# Altium schematic sheet Scheme.SchDoc
size A2; SheetNumber: 1; SheetTotal: 2
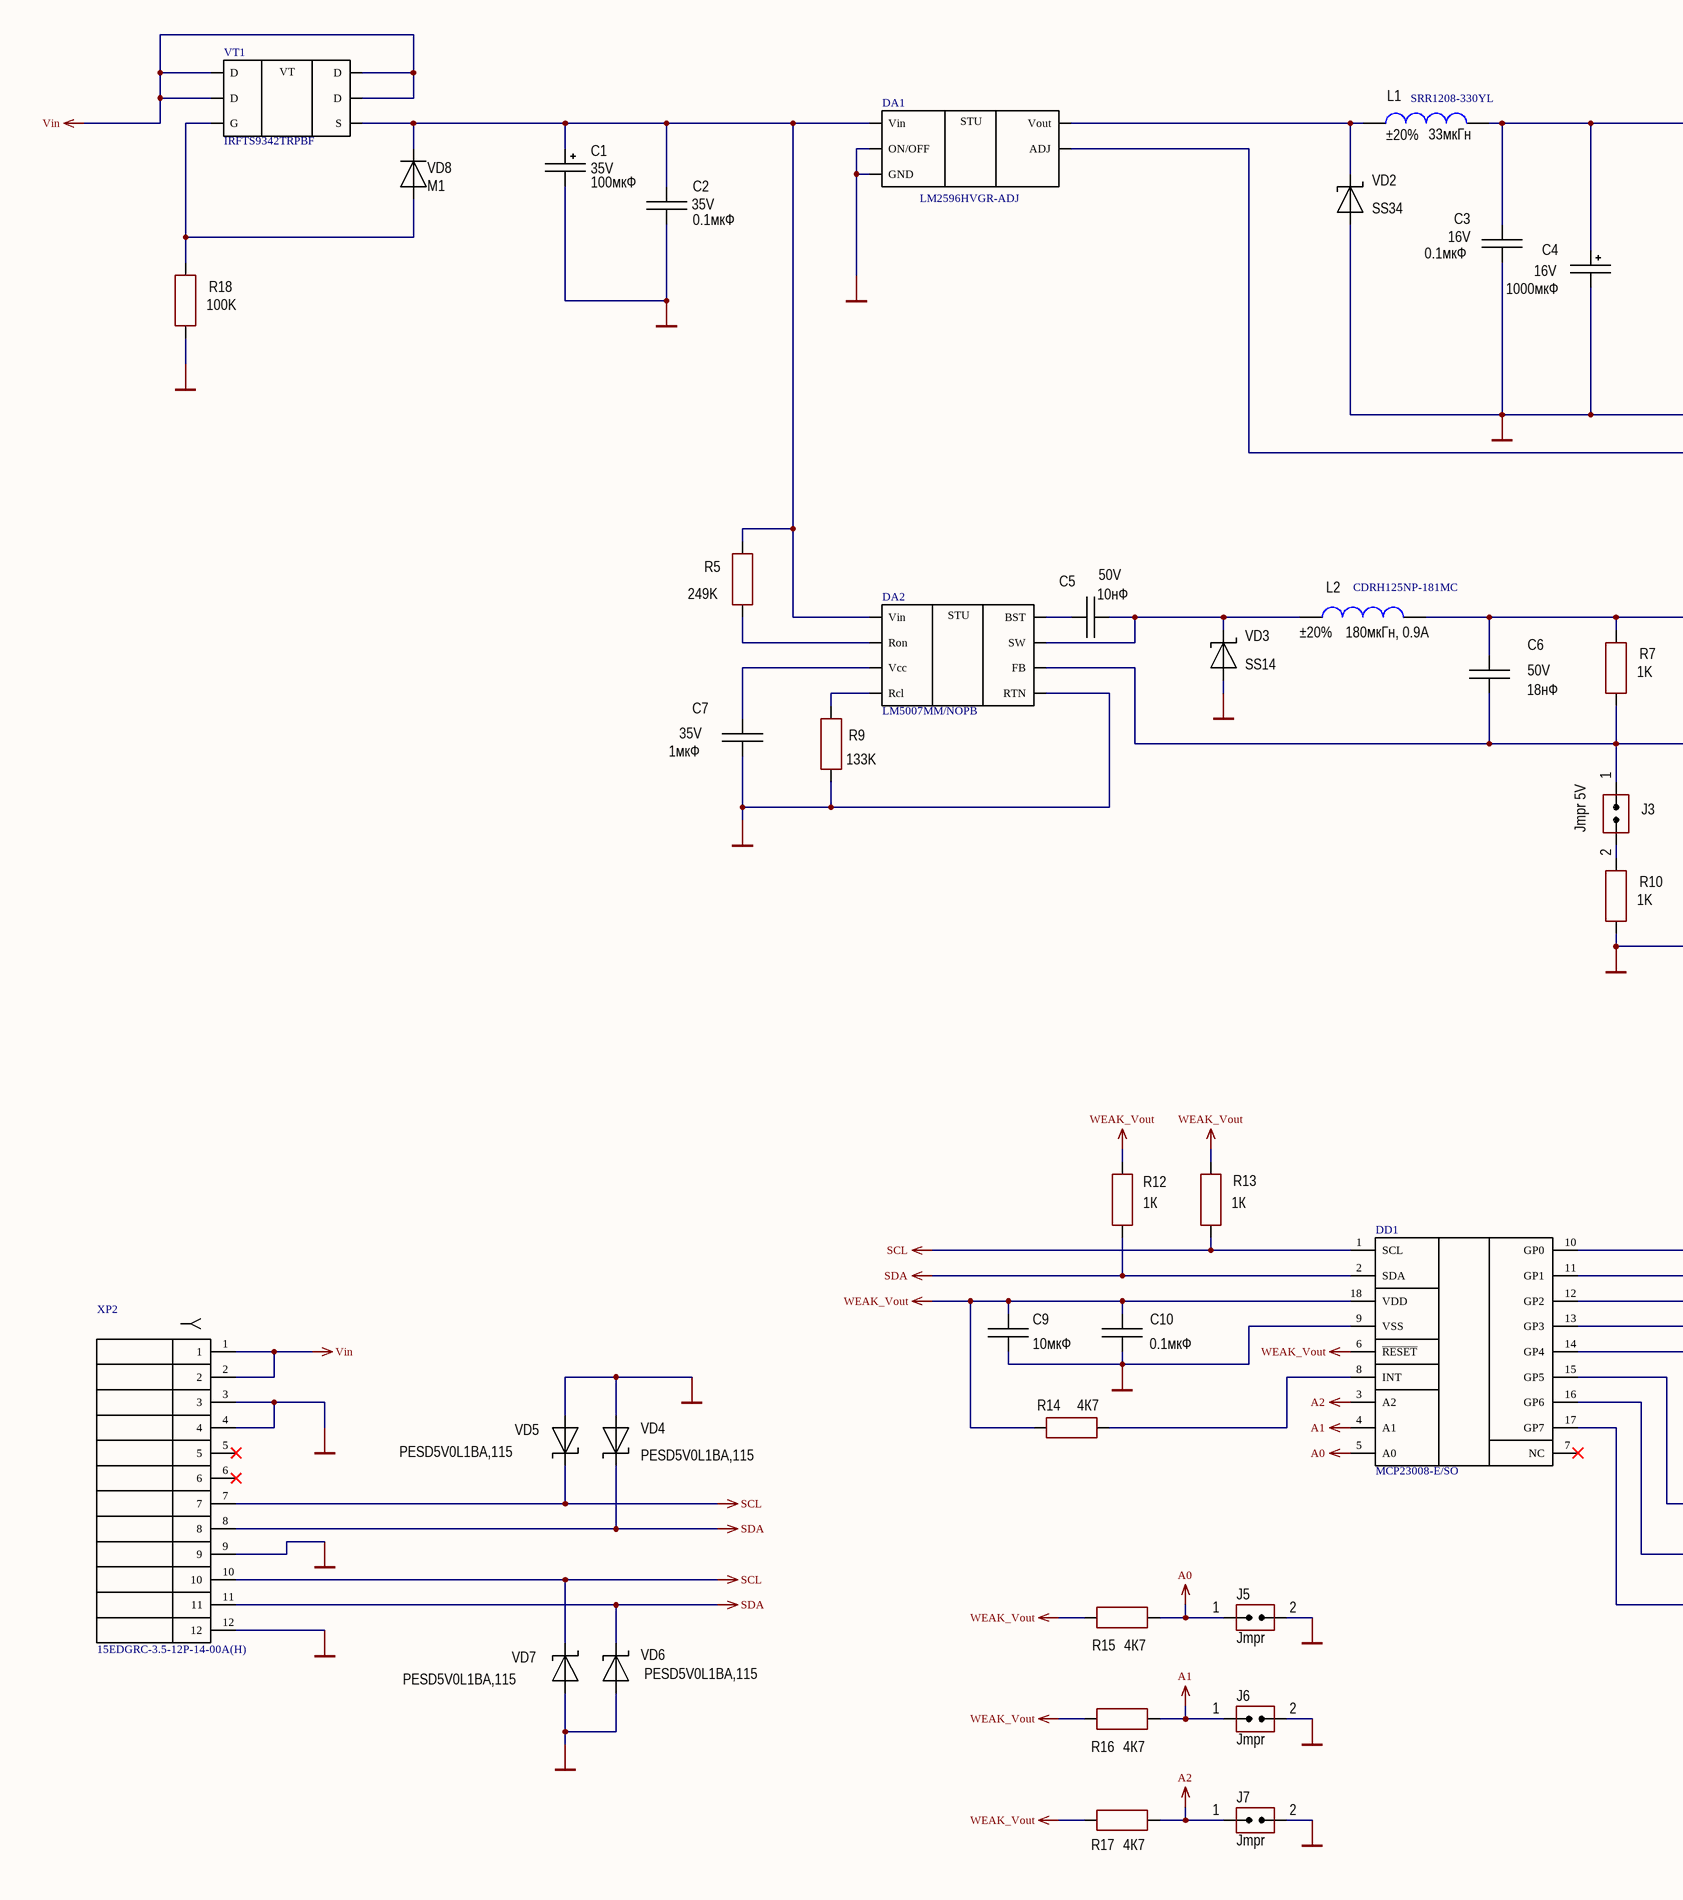
[diagram p0: Scheme.SchDoc, left]
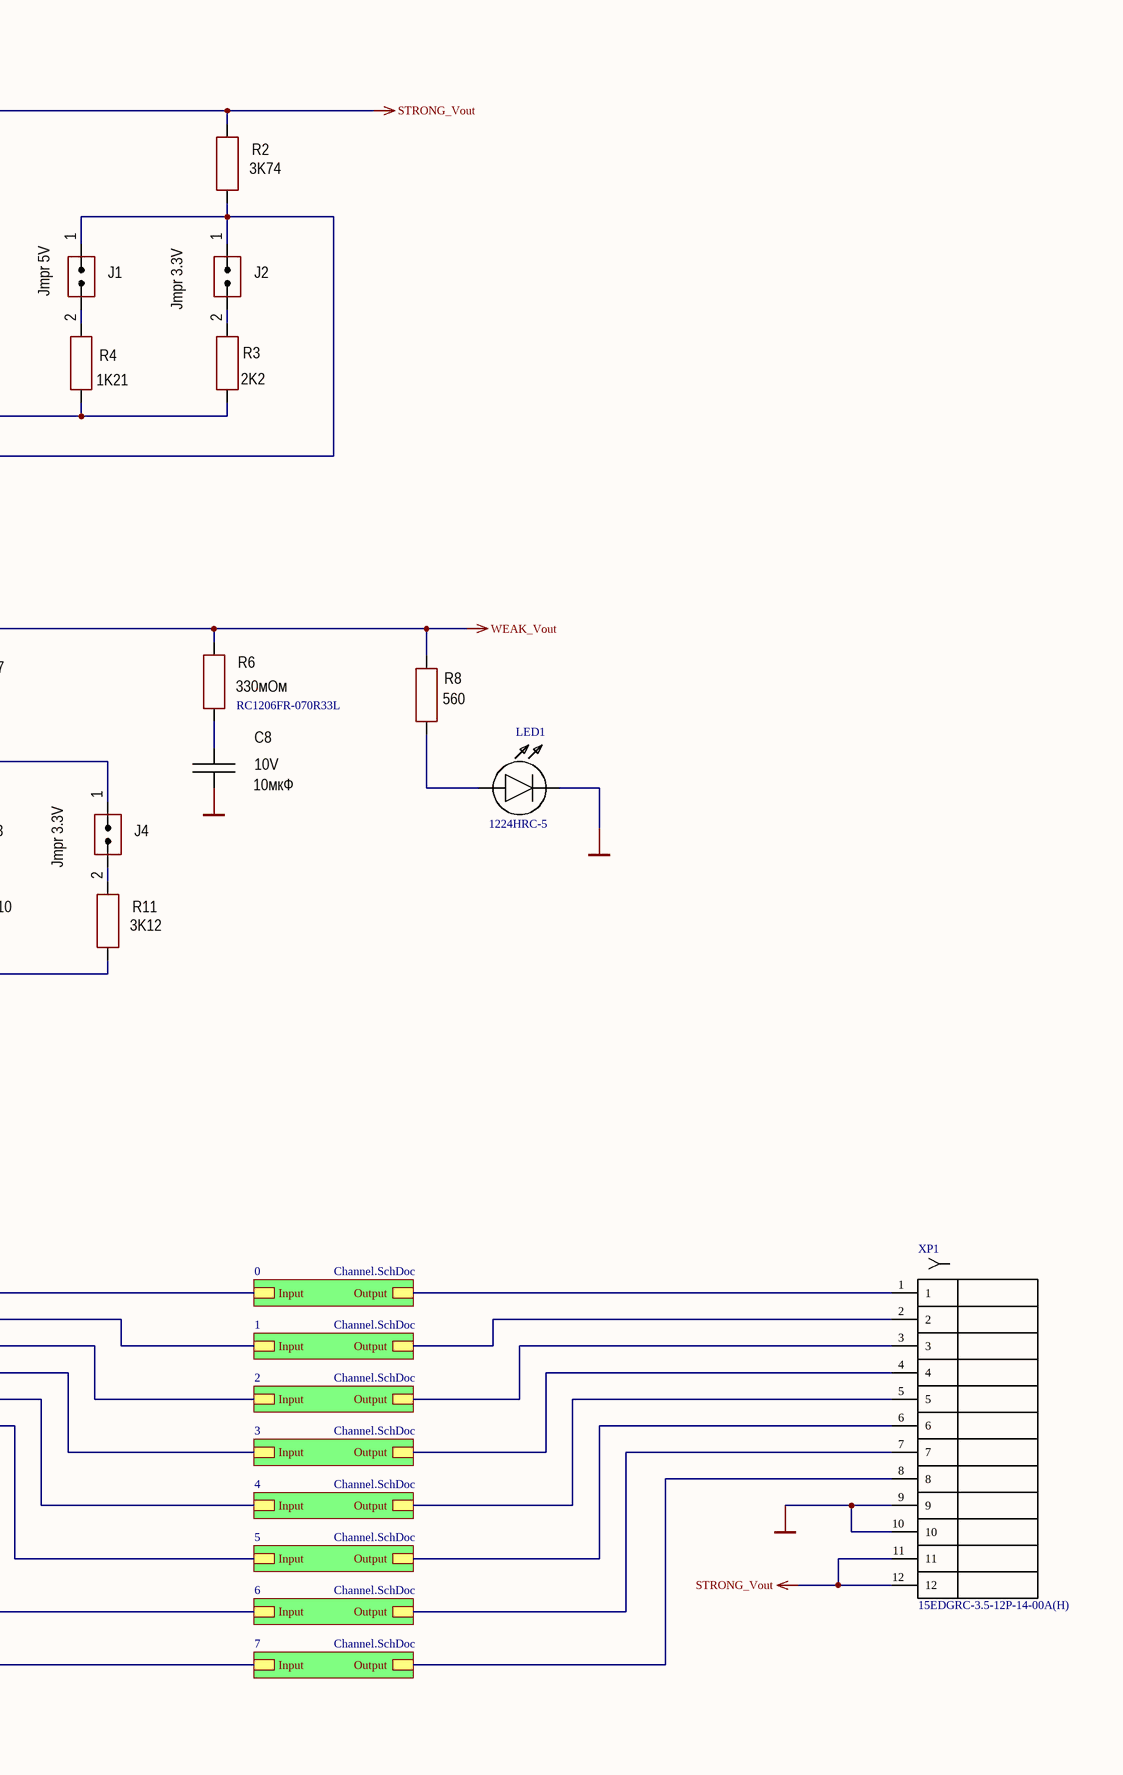
[diagram p1: Scheme.SchDoc, right]

## Parts
C1  value 100мкФ  Voltage: 35V  [CAP: D6.3C2.5H11]
C2  value 0.1мкФ  Voltage: 35V  [CAP: 0805]
C3  value 0.1мкФ  Voltage: 16V  [CAP: 0805]
C4  value 1000мкФ  Voltage: 16V  [CAP: D10C5H16]
C5  value 10нФ  Voltage: 50V  [CAP: 0805]
C6  value 18нФ  Voltage: 50V  [CAP: 0805]
C7  value 1мкФ  Voltage: 35V  [CAP: 0805]
C8  value 10мкФ  Voltage: 10V  [CAP: 0805]
C9  value 10мкФ  [CAP: 0805]
C10  value 0.1мкФ  [CAP: 0805]
DA1  LM2596HVGR-ADJ  [to-263-5l]
DA2  LM5007MM/NOPB  [8-VSSOP_EDIT]
DD1  MCP23008-E/SO  [18-SOIC]
J1  CommentText: Jmpr 5V  [CON: JUMPER x1]
J2  CommentText: Jmpr 3.3V  [CON: JUMPER x1]
J3  CommentText: Jmpr 5V  [CON: JUMPER x1]
J4  CommentText: Jmpr 3.3V  [CON: JUMPER x1]
J5  CommentText: Jmpr  [CON: JUMPER x1]
J6  CommentText: Jmpr  [CON: JUMPER x1]
J7  CommentText: Jmpr  [CON: JUMPER x1]
L1  value 33мкГн  Tolerance: ±20%  [SRR1208-330YL]
L2  value 180мкГн, 0.9A  Tolerance: ±20%  [CDRH125NP-181MC]
LED1  1224HRC-5  [1224HRC5]
R2  value 3K74  [RES: 0805]
R3  value 2K2  [RES: 0805]
R4  value 1K21  [RES: 0805]
R5  value 249K  [RES: 0805]
R6  RC1206FR-070R33L  value 330мОм  [RES: 1206]
R7  value 1K  [RES: 0805]
R8  value 560  [RES: 0805]
R9  value 133K  [RES: 0805]
R10  value 1K  [RES: 0805]
R11  value 3K12  [RES: 0805]
R12  value 1К  [RES: 0805]
R13  value 1К  [RES: 0805]
R14  value 4К7  [RES: 0805]
R15  value 4К7  [RES: 0805]
R16  value 4К7  [RES: 0805]
R17  value 4К7  [RES: 0805]
R18  value 100K  [RES: 0805]
VD2  PartNumber: SS34  [DIODE: SMC]
VD3  PartNumber: SS14  [DIODE: SMA]
VD4  PartNumber: PESD5V0L1BA,115  [DIODE: SOD323]
VD5  PartNumber: PESD5V0L1BA,115  [DIODE: SOD323]
VD6  PartNumber: PESD5V0L1BA,115  [DIODE: SOD323]
VD7  PartNumber: PESD5V0L1BA,115  [DIODE: SOD323]
VD8  PartNumber: M1  [DIODE: SMA]
VT1  IRFTS9342TRPBF  [6-TSOP]
XP1  15EDGRC-3.5-12P-14-00A(H)  [15EDGRC-3.5-12P-14-00A(H)]
XP2  15EDGRC-3.5-12P-14-00A(H)  [15EDGRC-3.5-12P-14-00A(H)]

## Sub-sheets
0 = Channel.SchDoc: Input, Output
1 = Channel.SchDoc: Input, Output
2 = Channel.SchDoc: Input, Output
3 = Channel.SchDoc: Input, Output
4 = Channel.SchDoc: Input, Output
5 = Channel.SchDoc: Input, Output
6 = Channel.SchDoc: Input, Output
7 = Channel.SchDoc: Input, Output

## Nets
A0: DD1.5(A0) J5.1(IN) R15.2
A1: DD1.4(A1) J6.1(IN) R16.2
A2: DD1.3(A2) J7.1(IN) R17.2
GND: C1.2 C2.1 C3.1 C4.2 C7.1 C8.2 C9.1 C10.1 DA1.3(GND) DA1.5(ON/OFF) DA2.4(RTN) DD1.9(VSS) J5.2(IN) J6.2(IN) J7.2(IN) LED1.1(K) R3.2 R4.1 R9.2 R10.1 R11.1 R18.1 VD2.1 VD3.1 VD4.1 VD5.1 VD6.1 VD7.1 XP1.9 XP1.10 XP2.3 XP2.4 XP2.9 XP2.12
SCL: DD1.1(SCL) R13.1 VD5.2 VD7.2 XP2.7 XP2.10
SDA: DD1.2(SDA) R12.1 VD4.2 VD6.2 XP2.8 XP2.11
STRONG_Vout: C3.2 C4.1 L1.1 R2.2 XP1.11 XP1.12
Vin: VT1.1(D) VT1.2(D) VT1.5(D) VT1.6(D) XP2.1 XP2.2
WEAK_Vout: C6.1 C9.2 C10.2 DD1.6(~{RESET}) DD1.18(VDD) L2.1 R6.2 R7.2 R8.1 R12.2 R13.2 R14.1 R15.1 R16.1 R17.1
NetC1_1: C1.1 C2.2 DA1.1(Vin) DA2.8(Vin) R5.2 VD8.2 VT1.4(S)
NetC5_1: C5.1 DA2.1(SW) L2.2 VD3.2
NetC5_2: C5.2 DA2.2(BST)
NetC6_2: C6.2 DA2.5(FB) J3.1(IN) J4.1(IN) R7.1
NetC7_2: C7.2 DA2.7(Vcc)
NetC8_1: C8.1 R6.1
NetDA1_2: DA1.2(Vout) L1.2 VD2.2
NetDA1_4: DA1.4(ADJ) J1.1(IN) J2.1(IN) R2.1
NetDA2_3: DA2.3(Rcl) R9.1
NetDA2_6: DA2.6(Ron) R5.1
NetDD1_8: DD1.8(INT) R14.2
NetDD1_10: DD1.10(GP0) ; sheet 0/Input
NetDD1_11: DD1.11(GP1) ; sheet 1/Input
NetDD1_12: DD1.12(GP2) ; sheet 2/Input
NetDD1_13: DD1.13(GP3) ; sheet 3/Input
NetDD1_14: DD1.14(GP4) ; sheet 4/Input
NetDD1_15: DD1.15(GP5) ; sheet 5/Input
NetDD1_16: DD1.16(GP6) ; sheet 6/Input
NetDD1_17: DD1.17(GP7) ; sheet 7/Input
NetJ1_2: J1.2(IN) R4.2
NetJ2_2: J2.2(IN) R3.1
NetJ3_2: J3.2(IN) R10.2
NetJ4_2: J4.2(IN) R11.2
NetLED1_2: LED1.2(A) R8.2
NetR18_2: R18.2 VD8.1 VT1.3(G)
NetXP1_1: XP1.1 ; sheet 0/Output
NetXP1_2: XP1.2 ; sheet 1/Output
NetXP1_3: XP1.3 ; sheet 2/Output
NetXP1_4: XP1.4 ; sheet 3/Output
NetXP1_5: XP1.5 ; sheet 4/Output
NetXP1_6: XP1.6 ; sheet 5/Output
NetXP1_7: XP1.7 ; sheet 6/Output
NetXP1_8: XP1.8 ; sheet 7/Output

Not connected (* = marked no-connect by the designer): DD1 7(NC)*; XP2 5* 6*

## Notes on the sheet
- (near L1) SRR1208-330YL
- (near L2) CDRH125NP-181MC
- (in symbol IRFTS9342TRPBF) VT
- (in symbol LM2596HVGR-ADJ) STU
- (in symbol LM5007MM/NOPB) STU

## Library data of the parts
C1 = Aluminium: Manufacturer: Wurth; PartNumber: 860080475013; ValueManufacturerPartNumber: Aluminium capacitor, 100мкФ, 35V, ±20%, 54mOhm, 14x10x5 mm, -55...+105°C; TypeCapacitor: Aluminium capacitor; Tolerance: ±20%; Impedance: 54mOhm; Package: 14x10x5 mm; HelpURL: https://www.digikey.com/product-detail/en/wurth-electronics-inc/860080475013/732-9029-1-ND/5728972; Temperature: -55...+105°C
C2 = Ceramic_0805: Manufacturer: Yageo; PartNumber: CC0805KRX7R7BB104; ValueManufacturerPartNumber: Ceramic capacitor, 0.1мкФ, X7R, ±10%, 35V, 0805, -55...+125°C; TypeCapacitor: Ceramic capacitor; Tolerance: ±10%; TypeDielectric: X7R; Package: 0805; HelpURL: https://www.digikey.com/product-detail/en/yageo/CC0805KRX7R7BB104/311-1142-1-ND/303052; Temperature: -55...+125°C
C3 = Ceramic_0805: Manufacturer: Yageo; PartNumber: CC0805KRX7R7BB104; ValueManufacturerPartNumber: Ceramic capacitor, 0.1мкФ, X7R, ±10%, 16V, 0805, -55...+125°C; TypeCapacitor: Ceramic capacitor; Tolerance: ±10%; TypeDielectric: X7R; Package: 0805; HelpURL: https://www.digikey.com/product-detail/en/yageo/CC0805KRX7R7BB104/311-1142-1-ND/303052; Temperature: -55...+125°C
C4 = Aluminium: Manufacturer: Wurth; PartNumber: 860080475013; ValueManufacturerPartNumber: Aluminium capacitor, 1000мкФ, 16V, ±20%, 54mOhm, 14x10x5 mm, -55...+105°C; TypeCapacitor: Aluminium capacitor; Tolerance: ±20%; Impedance: 54mOhm; Package: 14x10x5 mm; HelpURL: https://www.digikey.com/product-detail/en/wurth-electronics-inc/860080475013/732-9029-1-ND/5728972; Temperature: -55...+105°C
C5 = Ceramic_0805: Manufacturer: Yageo; PartNumber: CC0805KRX7R7BB104; ValueManufacturerPartNumber: Ceramic capacitor, 10нФ, X7R, ±10%, 50V, 0805, -55...+125°C; TypeCapacitor: Ceramic capacitor; Tolerance: ±10%; TypeDielectric: X7R; Package: 0805; HelpURL: https://www.digikey.com/product-detail/en/yageo/CC0805KRX7R7BB104/311-1142-1-ND/303052; Temperature: -55...+125°C
C6 = Ceramic_0805: Manufacturer: Yageo; PartNumber: CC0805KRX7R7BB104; ValueManufacturerPartNumber: Ceramic capacitor, 18нФ, X7R, ±10%, 50V, 0805, -55...+125°C; TypeCapacitor: Ceramic capacitor; Tolerance: ±10%; TypeDielectric: X7R; Package: 0805; HelpURL: https://www.digikey.com/product-detail/en/yageo/CC0805KRX7R7BB104/311-1142-1-ND/303052; Temperature: -55...+125°C
C7 = Ceramic_0805: Manufacturer: Yageo; PartNumber: CC0805KRX7R7BB104; ValueManufacturerPartNumber: Ceramic capacitor, 1мкФ, X7R, ±10%, 35V, 0805, -55...+125°C; TypeCapacitor: Ceramic capacitor; Tolerance: ±10%; TypeDielectric: X7R; Package: 0805; HelpURL: https://www.digikey.com/product-detail/en/yageo/CC0805KRX7R7BB104/311-1142-1-ND/303052; Temperature: -55...+125°C
C8 = Ceramic_0805: Manufacturer: Yageo; PartNumber: CC0805KRX7R7BB104; ValueManufacturerPartNumber: Ceramic capacitor, 10мкФ, X7R, ±10%, 10V, 0805, -55...+125°C; TypeCapacitor: Ceramic capacitor; Tolerance: ±10%; TypeDielectric: X7R; Package: 0805; HelpURL: https://www.digikey.com/product-detail/en/yageo/CC0805KRX7R7BB104/311-1142-1-ND/303052; Temperature: -55...+125°C
C9 = Ceramic_0805: Manufacturer: Yageo; PartNumber: CC0805KRX7R7BB104; ValueManufacturerPartNumber: Ceramic capacitor, 10мкФ, X7R, ±10%, 16V, 0805, -55...+125°C; TypeCapacitor: Ceramic capacitor; Tolerance: ±10%; TypeDielectric: X7R; Voltage: 16V; Package: 0805; HelpURL: https://www.digikey.com/product-detail/en/yageo/CC0805KRX7R7BB104/311-1142-1-ND/303052; Temperature: -55...+125°C
C10 = Ceramic_0805: Manufacturer: Yageo; PartNumber: CC0805KRX7R7BB104; ValueManufacturerPartNumber: Ceramic capacitor, 0.1мкФ, X7R, ±10%, 16V, 0805, -55...+125°C; TypeCapacitor: Ceramic capacitor; Tolerance: ±10%; TypeDielectric: X7R; Voltage: 16V; Package: 0805; HelpURL: https://www.digikey.com/product-detail/en/yageo/CC0805KRX7R7BB104/311-1142-1-ND/303052; Temperature: -55...+125°C
DA1 = LM2596HVGR-ADJ: Step-down DC-DC, 3A
DA2 = LM5007MM/NOPB: Step-down DC-DC, 0.5A
DD1 = MCP23008-E/SO: Integrated Circuit
J1-J7 = Jumper_single
L1 = Inductor_0805: https://www.chipdip.ru/product/srr1208-330yl; Manufacturer: Murata Electronics; PartNumber: LQM21FN100M70L; ValueManufacturerPartNumber: Fixed inductor, 33мкГн, ±20%, 0805, 100mA, -55...+125°C; TypeInductor: Fixed inductor; MaxCurrent: 100mA; Package: 0805; HelpURL: https://www.digikey.com/product-detail/en/murata-electronics-north-america/LQM21FN100M70L/490-4029-1-ND/1016289; Temperature: -55...+125°C
L2 = Inductor_0805: https://www.chipdip.ru/product/srr1208-330yl; Manufacturer: Murata Electronics; PartNumber: LQM21FN100M70L; ValueManufacturerPartNumber: Fixed inductor, 180мкГн, 0.9A, ±20%, 0805, 100mA, -55...+125°C; TypeInductor: Fixed inductor; MaxCurrent: 100mA; Package: 0805; HelpURL: https://www.digikey.com/product-detail/en/murata-electronics-north-america/LQM21FN100M70L/490-4029-1-ND/1016289; Temperature: -55...+125°C
LED1 = 1224HRC-5: LED; Manufacturer_Name: Everlight; Datasheet Link: https://www.digchip.com/datasheets/parts/datasheet/158/1224HRC-5-pdf.php; Height: 5.5mm; Manufacturer_Part_Number: 1224HRC-5
R2 = Resistor_0805: Manufacturer: Yageo; PartNumber: RC0805JR-07100RL; ValueManufacturerPartNumber: Resistor film, 3K74, ±5%, 0805, 0.125W, -55...+125°C; TypeResistor: Resistor film; Power: 0.125W; Tolerance: ±5%; Package: 0805; HelpURL: https://www.digikey.com/product-detail/en/yageo/RC0805JR-07100RL/311-100ARCT-ND/731185; Temperature: -55...+125°C
R3 = Resistor_0805: Manufacturer: Yageo; PartNumber: RC0805JR-07100RL; ValueManufacturerPartNumber: Resistor film, 2K2, ±5%, 0805, 0.125W, -55...+125°C; TypeResistor: Resistor film; Power: 0.125W; Tolerance: ±5%; Package: 0805; HelpURL: https://www.digikey.com/product-detail/en/yageo/RC0805JR-07100RL/311-100ARCT-ND/731185; Temperature: -55...+125°C
R4 = Resistor_0805: Manufacturer: Yageo; PartNumber: RC0805JR-07100RL; ValueManufacturerPartNumber: Resistor film, 1K21, ±5%, 0805, 0.125W, -55...+125°C; TypeResistor: Resistor film; Power: 0.125W; Tolerance: ±5%; Package: 0805; HelpURL: https://www.digikey.com/product-detail/en/yageo/RC0805JR-07100RL/311-100ARCT-ND/731185; Temperature: -55...+125°C
R5 = Resistor_0805: Manufacturer: Yageo; PartNumber: RC0805JR-07100RL; ValueManufacturerPartNumber: Resistor film, 249K, ±5%, 0805, 0.125W, -55...+125°C; TypeResistor: Resistor film; Power: 0.125W; Tolerance: ±5%; Package: 0805; HelpURL: https://www.digikey.com/product-detail/en/yageo/RC0805JR-07100RL/311-100ARCT-ND/731185; Temperature: -55...+125°C
R6 = Resistor_1206: Manufacturer: Yageo; PartNumber: RC1206JR-07100RL; ValueManufacturerPartNumber: Resistor film, 330мОм, ±5%, 1206, 0.25W, -55...+125°C; TypeResistor: Resistor film; Power: 0.25W; Tolerance: ±5%; Package: 1206; HelpURL: https://www.digikey.com/product-detail/en/yageo/RC1206JR-07100RL/311-100ERCT-ND/732153; Temperature: -55...+125°C
R7 R10 = Resistor_0805: Manufacturer: Yageo; PartNumber: RC0805JR-07100RL; ValueManufacturerPartNumber: Resistor film, 1K, ±5%, 0805, 0.125W, -55...+125°C; TypeResistor: Resistor film; Power: 0.125W; Tolerance: ±5%; Package: 0805; HelpURL: https://www.digikey.com/product-detail/en/yageo/RC0805JR-07100RL/311-100ARCT-ND/731185; Temperature: -55...+125°C
R8 = Resistor_0805: Manufacturer: Yageo; PartNumber: RC0805JR-07100RL; ValueManufacturerPartNumber: Resistor film, 560, ±5%, 0805, 0.125W, -55...+125°C; TypeResistor: Resistor film; Power: 0.125W; Tolerance: ±5%; Package: 0805; HelpURL: https://www.digikey.com/product-detail/en/yageo/RC0805JR-07100RL/311-100ARCT-ND/731185; Temperature: -55...+125°C
R9 = Resistor_0805: Manufacturer: Yageo; PartNumber: RC0805JR-07100RL; ValueManufacturerPartNumber: Resistor film, 133K, ±5%, 0805, 0.125W, -55...+125°C; TypeResistor: Resistor film; Power: 0.125W; Tolerance: ±5%; Package: 0805; HelpURL: https://www.digikey.com/product-detail/en/yageo/RC0805JR-07100RL/311-100ARCT-ND/731185; Temperature: -55...+125°C
R11 = Resistor_0805: Manufacturer: Yageo; PartNumber: RC0805JR-07100RL; ValueManufacturerPartNumber: Resistor film, 3K12, ±5%, 0805, 0.125W, -55...+125°C; TypeResistor: Resistor film; Power: 0.125W; Tolerance: ±5%; Package: 0805; HelpURL: https://www.digikey.com/product-detail/en/yageo/RC0805JR-07100RL/311-100ARCT-ND/731185; Temperature: -55...+125°C
R12 R13 = Resistor_0805: Manufacturer: Yageo; PartNumber: RC0805JR-07100RL; ValueManufacturerPartNumber: Resistor film, 1К, ±5%, 0805, 0.125W, -55...+125°C; TypeResistor: Resistor film; Power: 0.125W; Tolerance: ±5%; Package: 0805; HelpURL: https://www.digikey.com/product-detail/en/yageo/RC0805JR-07100RL/311-100ARCT-ND/731185; Temperature: -55...+125°C
R14-R17 = Resistor_0805: Manufacturer: Yageo; PartNumber: RC0805JR-07100RL; ValueManufacturerPartNumber: Resistor film, 4К7, ±5%, 0805, 0.125W, -55...+125°C; TypeResistor: Resistor film; Power: 0.125W; Tolerance: ±5%; Package: 0805; HelpURL: https://www.digikey.com/product-detail/en/yageo/RC0805JR-07100RL/311-100ARCT-ND/731185; Temperature: -55...+125°C
R18 = Resistor_0805: Manufacturer: Yageo; PartNumber: RC0805JR-07100RL; ValueManufacturerPartNumber: Resistor film, 100K, ±5%, 0805, 0.125W, -55...+125°C; TypeResistor: Resistor film; Power: 0.125W; Tolerance: ±5%; Package: 0805; HelpURL: https://www.digikey.com/product-detail/en/yageo/RC0805JR-07100RL/311-100ARCT-ND/731185; Temperature: -55...+125°C
VD2 VD3 = Schottky_single: https://www.chipdip.ru/product/srr1208-330yl; Manufacturer: Diodes Incorporated; ValueManufacturerPartNumber: Schottky diode, 80V, 500mA, 1V, 15pF, SOD-123, -55...+150°C; TypeDiode: Schottky diode; Voltage: 80V; Current: 500mA; VoltageDrop: 1V; RecoveryTime: 15pF; Package: SOD-123; HelpURL: https://www.digikey.com/product-detail/en/diodes-incorporated/MBR0580S1-7/MBR0580S1-7DICT-ND/5080371; Temperature: -55...+150°C
VD4-VD7 = Schottky_single: Manufacturer: Diodes Incorporated; ValueManufacturerPartNumber: Schottky diode, 80V, 500mA, 1V, 15pF, SOD-123, -55...+150°C; TypeDiode: Schottky diode; Voltage: 80V; Current: 500mA; VoltageDrop: 1V; RecoveryTime: 15pF; Package: SOD-123; HelpURL: https://www.digikey.com/product-detail/en/diodes-incorporated/MBR0580S1-7/MBR0580S1-7DICT-ND/5080371; Temperature: -55...+150°C
VD8 = Diode_single: Manufacturer: Micro Commercial; ValueManufacturerPartNumber: Single diode, 75V, 150mA, 1V, 4ns, SOD-323, -55...+150°C; TypeDiode: Single diode; Voltage: 75V; Current: 150mA; VoltageDrop: 1V; RecoveryTime: 4ns; Package: SOD-323; HelpURL: https://www.digikey.com/product-detail/en/micro-commercial-co/1N4148WX-TP/1N4148WXTPMSCT-ND/717312; Temperature: -55...+150°C
VT1 = IRFTS9342TRPBF: Транзистор, Р-канал 30В 5.9А
XP1 XP2 = 15EDGRC-3.5-12P-14-00A(H): 12 pin, 3.5mm